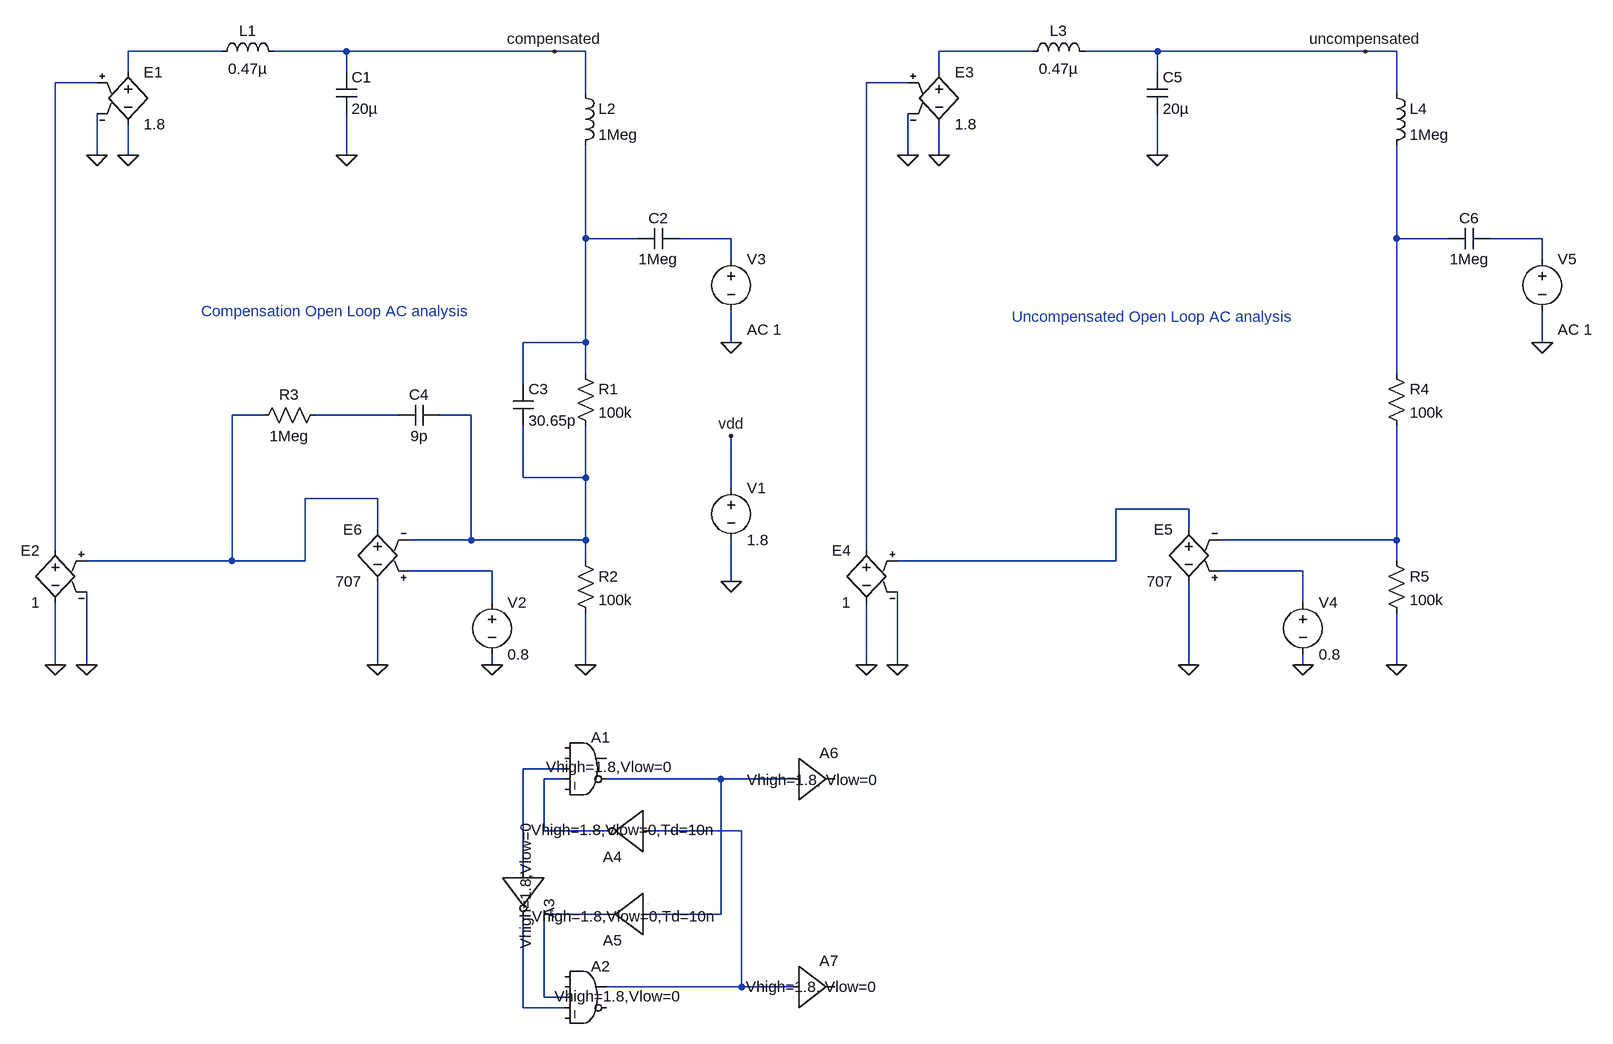
[diagram p0: schematic Scribble.asc]
Scribble.asc, the LTspice schematic file:
Version 4
SHEET 1 1636 1380
WIRE -928 -320 -1072 -320
WIRE -736 -320 -848 -320
WIRE -416 -320 -736 -320
WIRE -368 -320 -416 -320
WIRE 320 -320 176 -320
WIRE 512 -320 400 -320
WIRE 832 -320 512 -320
WIRE 880 -320 832 -320
WIRE -1072 -288 -1072 -320
WIRE -736 -288 -736 -320
WIRE 176 -288 176 -320
WIRE 512 -288 512 -320
WIRE -1120 -272 -1184 -272
WIRE 128 -272 64 -272
WIRE -368 -256 -368 -320
WIRE 880 -256 880 -320
WIRE -1120 -160 -1120 -224
WIRE -1072 -160 -1072 -208
WIRE -736 -160 -736 -224
WIRE 128 -160 128 -224
WIRE 176 -160 176 -208
WIRE 512 -160 512 -224
WIRE -368 -32 -368 -176
WIRE -288 -32 -368 -32
WIRE -144 -32 -224 -32
WIRE 880 -32 880 -176
WIRE 960 -32 880 -32
WIRE 1104 -32 1024 -32
WIRE -144 0 -144 -32
WIRE 1104 0 1104 -32
WIRE -368 128 -368 -32
WIRE -368 128 -464 128
WIRE -144 128 -144 80
WIRE 1104 128 1104 80
WIRE -368 176 -368 128
WIRE 880 176 880 -32
WIRE -464 192 -464 128
WIRE -864 240 -912 240
WIRE -656 240 -784 240
WIRE -544 240 -592 240
WIRE -464 336 -464 256
WIRE -368 336 -368 256
WIRE -368 336 -464 336
WIRE -144 352 -144 272
WIRE -688 368 -800 368
WIRE 560 384 448 384
WIRE -688 416 -688 368
WIRE 560 416 560 384
WIRE -544 432 -544 240
WIRE -544 432 -640 432
WIRE -368 432 -368 336
WIRE -368 432 -544 432
WIRE 880 432 880 256
WIRE 880 432 608 432
WIRE -1184 448 -1184 -272
WIRE 64 448 64 -272
WIRE -912 464 -912 240
WIRE -912 464 -1136 464
WIRE -800 464 -800 368
WIRE -800 464 -912 464
WIRE -368 464 -368 432
WIRE 448 464 448 384
WIRE 448 464 112 464
WIRE 880 464 880 432
WIRE -512 480 -640 480
WIRE 736 480 608 480
WIRE -144 496 -144 432
WIRE -512 528 -512 480
WIRE 736 528 736 480
WIRE -1184 624 -1184 528
WIRE -1136 624 -1136 512
WIRE -688 624 -688 496
WIRE -512 624 -512 608
WIRE -368 624 -368 544
WIRE 64 624 64 528
WIRE 112 624 112 512
WIRE 560 624 560 496
WIRE 736 624 736 608
WIRE 880 624 880 544
WIRE -400 784 -464 784
WIRE -400 800 -432 800
WIRE -160 800 -336 800
WIRE -48 800 -160 800
WIRE -432 880 -432 800
WIRE -336 880 -432 880
WIRE -128 880 -272 880
WIRE -464 944 -464 784
WIRE -336 1008 -432 1008
WIRE -160 1008 -160 800
WIRE -160 1008 -272 1008
WIRE -128 1120 -128 880
WIRE -128 1120 -336 1120
WIRE -48 1120 -128 1120
WIRE -432 1136 -432 1008
WIRE -400 1136 -432 1136
WIRE -464 1152 -464 1008
WIRE -400 1152 -464 1152
FLAG -1072 -160 0
FLAG -1120 -160 0
FLAG -1184 624 0
FLAG -1136 624 0
FLAG -688 624 0
FLAG -144 496 0
FLAG -144 272 vdd
FLAG -736 -160 0
FLAG -368 624 0
FLAG -512 624 0
FLAG -416 -320 compensated
FLAG -144 128 0
FLAG 176 -160 0
FLAG 128 -160 0
FLAG 64 624 0
FLAG 112 624 0
FLAG 560 624 0
FLAG 512 -160 0
FLAG 880 624 0
FLAG 736 624 0
FLAG 832 -320 uncompensated
FLAG 1104 128 0
SYMBOL e -1072 -304 R0
SYMATTR InstName E1
SYMATTR Value 1.8
SYMBOL ind -944 -304 R270
WINDOW 0 32 56 VTop 2
WINDOW 3 5 56 VBottom 2
SYMATTR InstName L1
SYMATTR Value 0.47µ
SYMATTR SpiceLine Rser=32m
SYMBOL cap -752 -288 R0
SYMATTR InstName C1
SYMATTR Value 20µ
SYMBOL e -1184 432 M0
SYMATTR InstName E2
SYMATTR Value 1
SYMBOL voltage -144 336 R0
WINDOW 123 0 0 Left 0
WINDOW 39 0 0 Left 0
SYMATTR InstName V1
SYMATTR Value 1.8
SYMBOL res -384 160 R0
SYMATTR InstName R1
SYMATTR Value 100k
SYMBOL res -384 448 R0
SYMATTR InstName R2
SYMATTR Value 100k
SYMBOL voltage -512 512 R0
WINDOW 123 0 0 Left 0
WINDOW 39 0 0 Left 0
SYMATTR InstName V2
SYMATTR Value 0.8
SYMBOL cap -224 -48 R90
WINDOW 0 0 32 VBottom 2
WINDOW 3 32 32 VTop 2
SYMATTR InstName C2
SYMATTR Value 1Meg
SYMBOL ind -384 -272 R0
SYMATTR InstName L2
SYMATTR Value 1Meg
SYMBOL voltage -144 -16 R0
WINDOW 123 24 124 Left 2
WINDOW 39 0 0 Left 0
SYMATTR Value2 AC 1
SYMATTR InstName V3
SYMATTR Value ""
SYMBOL cap -480 192 R0
SYMATTR InstName C3
SYMATTR Value 30.65p
SYMBOL res -768 224 R90
WINDOW 0 0 56 VBottom 2
WINDOW 3 32 56 VTop 2
SYMATTR InstName R3
SYMATTR Value 1Meg
SYMBOL cap -592 224 R90
WINDOW 0 0 32 VBottom 2
WINDOW 3 32 32 VTop 2
SYMATTR InstName C4
SYMATTR Value 9p
SYMBOL e 176 -304 R0
SYMATTR InstName E3
SYMATTR Value 1.8
SYMBOL ind 304 -304 R270
WINDOW 0 32 56 VTop 2
WINDOW 3 5 56 VBottom 2
SYMATTR InstName L3
SYMATTR Value 0.47µ
SYMATTR SpiceLine Rser=32m
SYMBOL cap 496 -288 R0
SYMATTR InstName C5
SYMATTR Value 20µ
SYMBOL e 64 432 M0
SYMATTR InstName E4
SYMATTR Value 1
SYMBOL res 864 160 R0
SYMATTR InstName R4
SYMATTR Value 100k
SYMBOL res 864 448 R0
SYMATTR InstName R5
SYMATTR Value 100k
SYMBOL voltage 736 512 R0
WINDOW 123 0 0 Left 0
WINDOW 39 0 0 Left 0
SYMATTR InstName V4
SYMATTR Value 0.8
SYMBOL cap 1024 -48 R90
WINDOW 0 0 32 VBottom 2
WINDOW 3 32 32 VTop 2
SYMATTR InstName C6
SYMATTR Value 1Meg
SYMBOL ind 864 -272 R0
SYMATTR InstName L4
SYMATTR Value 1Meg
SYMBOL voltage 1104 -16 R0
WINDOW 123 24 124 Left 2
WINDOW 39 0 0 Left 0
SYMATTR Value2 AC 1
SYMATTR InstName V5
SYMATTR Value ""
SYMBOL e2 560 400 M0
SYMATTR InstName E5
SYMATTR Value 707
SYMBOL e2 -688 400 M0
SYMATTR InstName E6
SYMATTR Value 707
SYMBOL Digital\\and -368 720 R0
WINDOW 3 -61 61 Left 2
SYMATTR Value Vhigh=1.8,Vlow=0
SYMATTR InstName A1
SYMBOL Digital\\and -368 1072 R0
WINDOW 3 -48 62 Left 2
SYMATTR Value Vhigh=1.8,Vlow=0
SYMATTR InstName A2
SYMBOL Digital\\inv -400 944 R90
WINDOW 3 -78 60 Left 2
SYMATTR Value Vhigh=1.8,Vlow=0
SYMATTR InstName A3
SYMBOL Digital\\inv -272 944 R180
WINDOW 3 -106 66 Left 2
SYMATTR Value Vhigh=1.8,Vlow=0,Td=10n
SYMATTR InstName A4
SYMBOL Digital\\buf1 -272 1072 R180
WINDOW 3 -107 61 Left 2
SYMATTR Value Vhigh=1.8,Vlow=0,Td=10n
SYMATTR InstName A5
SYMBOL Digital\\buf1 -48 736 R0
WINDOW 3 -72 65 Left 2
SYMATTR Value Vhigh=1.8, Vlow=0
SYMATTR InstName A6
SYMBOL Digital\\buf1 -48 1056 R0
WINDOW 3 -73 64 Left 2
SYMATTR Value Vhigh=1.8, Vlow=0
SYMATTR InstName A7
TEXT 288 88 Left 2 ;Uncompensated Open Loop AC analysis
TEXT -960 80 Left 2 ;Compensation Open Loop AC analysis

The netlist it stands for:
* Scribble.asc
E1 N001 0 N003 0 1.8
L1 N001 compensated 0.47µ Rser=32m
C1 compensated 0 20µ
E2 N003 0 N009 0 1
V1 vdd 0 1.8
R1 N005 N011 100k
R2 N011 0 100k
V2 N014 0 0.8
C2 N006 N005 1Meg
L2 compensated N005 1Meg
V3 N006 0 AC 1
C3 N005 N011 30.65p
R3 N010 N009 1Meg
C4 N011 N010 9p
E3 N002 0 N004 0 1.8
L3 N002 uncompensated 0.47µ Rser=32m
C5 uncompensated 0 20µ
E4 N004 0 N012 0 1
R4 N007 N013 100k
R5 N013 0 100k
V4 N015 0 0.8
C6 N008 N007 1Meg
L4 uncompensated N007 1Meg
V5 N008 0 AC 1
E5 N012 0 N015 N013 707
E6 N009 0 N014 N011 707
A1 0 0 N016 N017 0 N018 0 0 AND Vhigh=1.8,Vlow=0
A2 0 0 N020 N021 0 0 N019 0 AND Vhigh=1.8,Vlow=0
A3 N016 0 0 0 0 N021 0 0 BUF Vhigh=1.8,Vlow=0
A4 N019 0 0 0 0 N017 0 0 BUF Vhigh=1.8,Vlow=0,Td=10n
A5 N018 0 0 0 0 0 N020 0 BUF Vhigh=1.8,Vlow=0,Td=10n
A6 N018 0 0 0 0 0 0 0 BUF Vhigh=1.8, Vlow=0
A7 N019 0 0 0 0 0 0 0 BUF Vhigh=1.8, Vlow=0
* Uncompensated Open Loop AC analysis
* Compensation Open Loop AC analysis
.backanno
.end